# EAGLE design FREA-K (EAGLE 7.6.0)
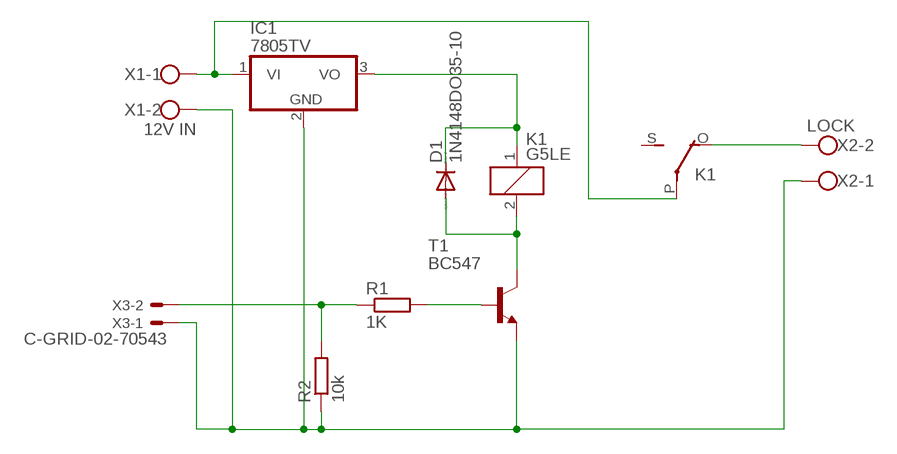
[diagram p0: schematic, sheet 1]

## Parts
D1  1N4148DO35-10  [DO35-10]
IC1  7805TV  [TO220V]
K1  G5LE  [G5LE]
R1  1K  R-EU_0204/7  [0204/7]
R2  10k  R-EU_0204/7  [0204/7]
T1  BC547  [TO92]
X1  12V IN  W237-102  [W237-102]
X2  LOCK  W237-102  [W237-102]
X3  C-GRID-02-70543  [70543-02]

## Nets
N$1: D1.C IC1.3(VO) K1.1
N$2: D1.A K1.2 T1.3(C)
N$3: IC1.2(GND) R2.1 T1.1(E) X1.2 X2.1 X3.1
N$4: R1.2 T1.2(B)
N$5: R1.1 R2.2 X3.2
N$7: IC1.1(VI) K1.P(2:P) X1.1
N$9: K1.O(2:O) X2.2
Unconnected: K1.S(2:S)

## Library data of the parts
D1 = diode:1N4148: DIODE high speed (Philips)
IC1 = linear:78*: Positive VOLTAGE REGULATOR Source: http://cache.national.com/ds/LM/LM78L05.pdf http://www.fairchildsemi.com/ds/LM/LM7805.pdf
K1 = relay:G5LE: RELAY 1 x switch, 10 A/120 V AC, 8 A/30 V DC, Omron; OC_FARNELL: unknown; OC_NEWARK: unknown
R1 R2 = rcl:R-EU_: RESISTOR, European symbol
T1 = transistor:BC547: NPN TRANSISTOR
X1 X2 = con-wago-500:W237-102: WAGO SCREW CLAMP; MPN: 237-102; OC_FARNELL: unknown; OC_NEWARK: 70K9898
X3 = con-molex:C-GRID-02: CONNECTOR wire to board 2.54 mm (0.100") pitch header; OC_FARNELL: unknown; OC_NEWARK: unknown

## Board
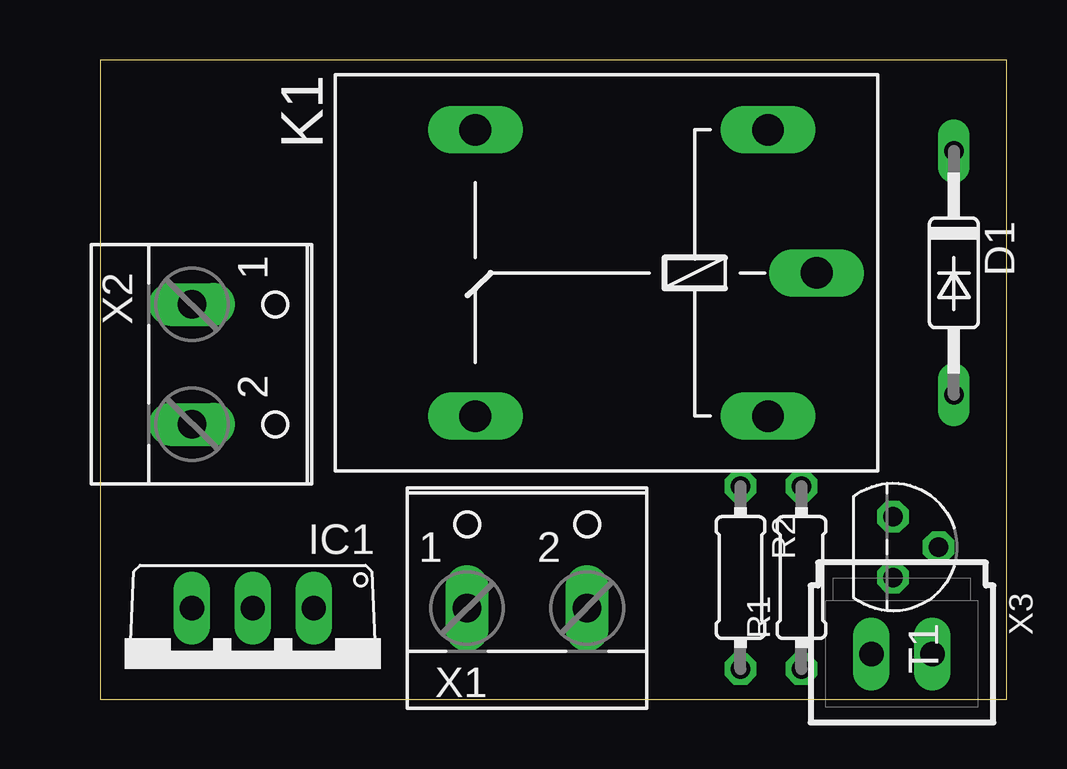
[diagram p1: board, top side]
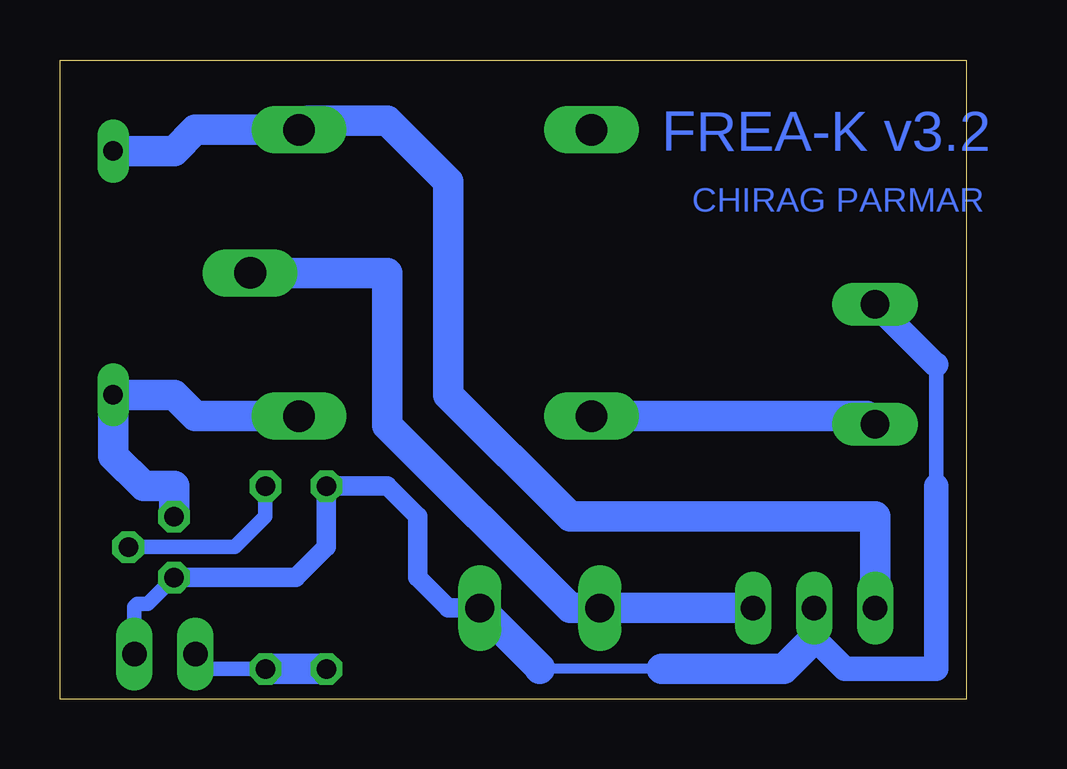
[diagram p2: board, bottom side, seen from below]

Size 37.77 x 26.66 mm. Coordinates in mm from the lower left corner, seen from the top.
Outline: 0,0 37.77,0 37.77,26.66 0,26.66 0,0
Copper layers (1*16): Top 0.035mm / dielectric 1.5mm / Bottom 0.035mm
Design rules "default": minimum track width 10mil, minimum drill 24mil, track to track 8mil, track to pad 8mil, pad to pad 8mil, via to via 8mil, smd to smd 8mil, copper to edge 40mil, drill to drill 8mil, minimum pad ring 10mil, minimum via ring 8mil, stop-mask expansion 4mil, vias tented up to drill 0mil, thermal gap 10mil

### Footprints (pad centres in the part's own frame; a part is rotated, then mirrored left to right if it is on the bottom)
DO35-10 = drill 0.813 long: A 5.08,0; C -5.08,0
TO220V = drill 1.016 long: 1 -2.54,-2.54; 2 0,-2.54; 3 2.54,-2.54
G5LE = drill 1.321 long: 1 -7.493,-5.969; 2 -7.493,5.969; O 4.699,5.969; P -9.525,0; S 4.699,-5.969
0204/7 = drill 0.813 octagon: 1 -3.81,0; 2 3.81,0
TO92 = drill 0.813 octagon: 1 1.27,0; 2 0,1.905; 3 -1.27,0
W237-102 = drill 1.194 long: 1 -2.5,-1.27; 2 2.5,-1.27
70543-02 = drill 1.016 long: 1 -1.27,0; 2 1.27,0

### Placement (x,y rotation side)
D1  35.56,17.78 270 top
IC1  6.35,1.27 180 top
K1  20.32,17.78 180 top
R1  29.21,5.08 90 top
R2  26.67,5.08 270 top
T1  33.02,6.35 270 top
X1  17.78,5.08 0 top
X2  5.08,13.97 270 top
X3  33.4,1.89 180 top

### Tracks (layer width: path | path; a pad name or v marks a point on that pad's centre or on a via)
N$1
  Bottom 1.27: IC1.3 3.81,7.62 16.51,7.62 21.59,12.7 21.59,21.59 24.13,24.13 27.43,24.13 K1.1 32.13,23.75 33.02,22.86 D1.C
N$2
  Bottom 1.27: K1.2 32.13,11.81 33.02,12.7 D1.A 35.56,10.16 34.29,8.89 33.02,8.89 T1.3
N$3
  Bottom 0.406: 12.7,1.27 17.78,1.27
  Bottom 0.61: 1.27,8.89 1.27,13.97 | X3.1 34.67,3.87 34.55,3.98 34.12,3.98 T1.1
  Bottom 0.813: X1.2 21.59,3.81 22.86,5.08 22.86,7.62 24.13,8.89 R2.1 26.67,6.35 27.94,5.08 T1.1
  Bottom 1.016: 6.35,2.54 5.08,1.27 1.27,1.27 1.27,8.89 | 1.27,13.97 1.31,13.97 X2.1
  Bottom 1.27: IC1.2 6.35,2.54 7.62,1.27 12.7,1.27 | 17.78,1.27 17.78,1.31 X1.2
N$4
  Bottom 0.61: R1.2 29.21,7.62 30.48,6.35 T1.2
N$5
  Bottom 0.61: R1.1 31.5,1.27 X3.2
  Bottom 1.27: R2.2 R1.1
N$7
  Bottom 1.27: IC1.1 X1.1 16.51,3.81 24.13,11.43 24.13,17.78 K1.P
N$9
  Bottom 1.27: K1.O 4.15,11.81 X2.2

### Text on the board
Bottom: FREA-K v3.2 | CHIRAG PARMAR